# EAGLE board CharacterRom (EAGLE 7.3.0), part 1 of 2
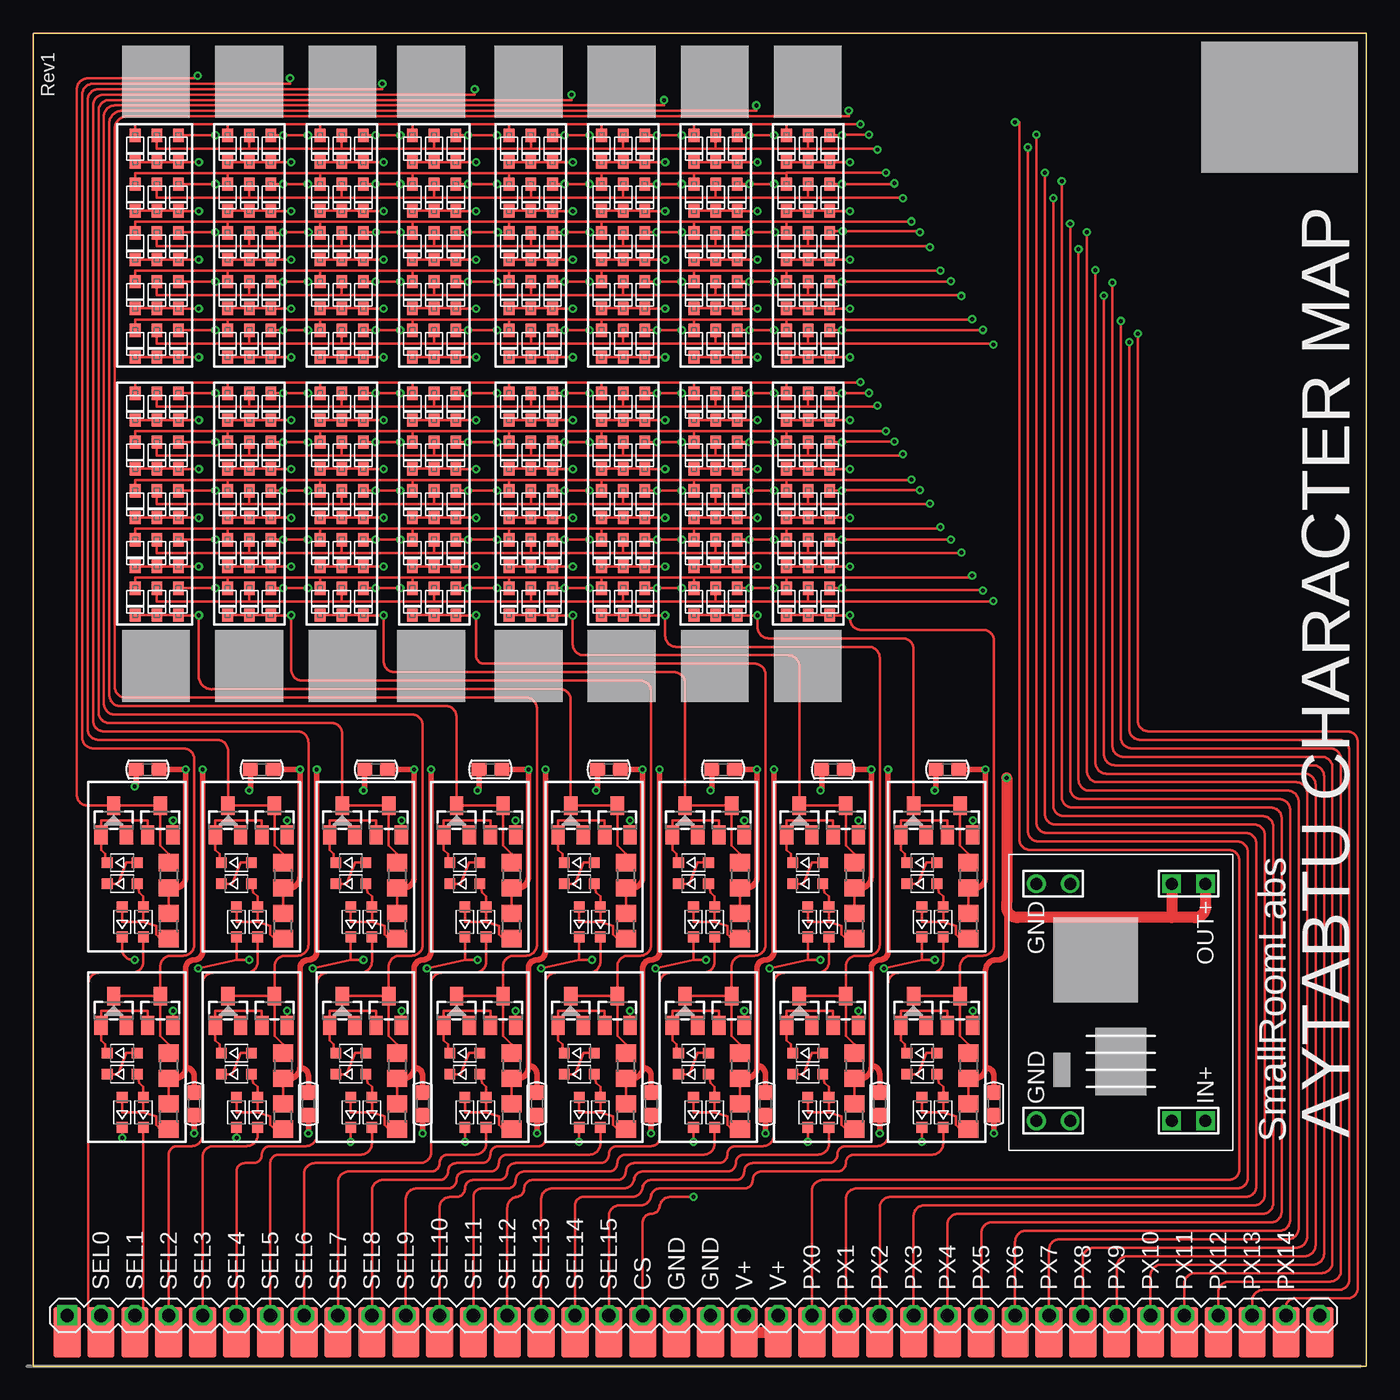
[diagram p3: board, top side]
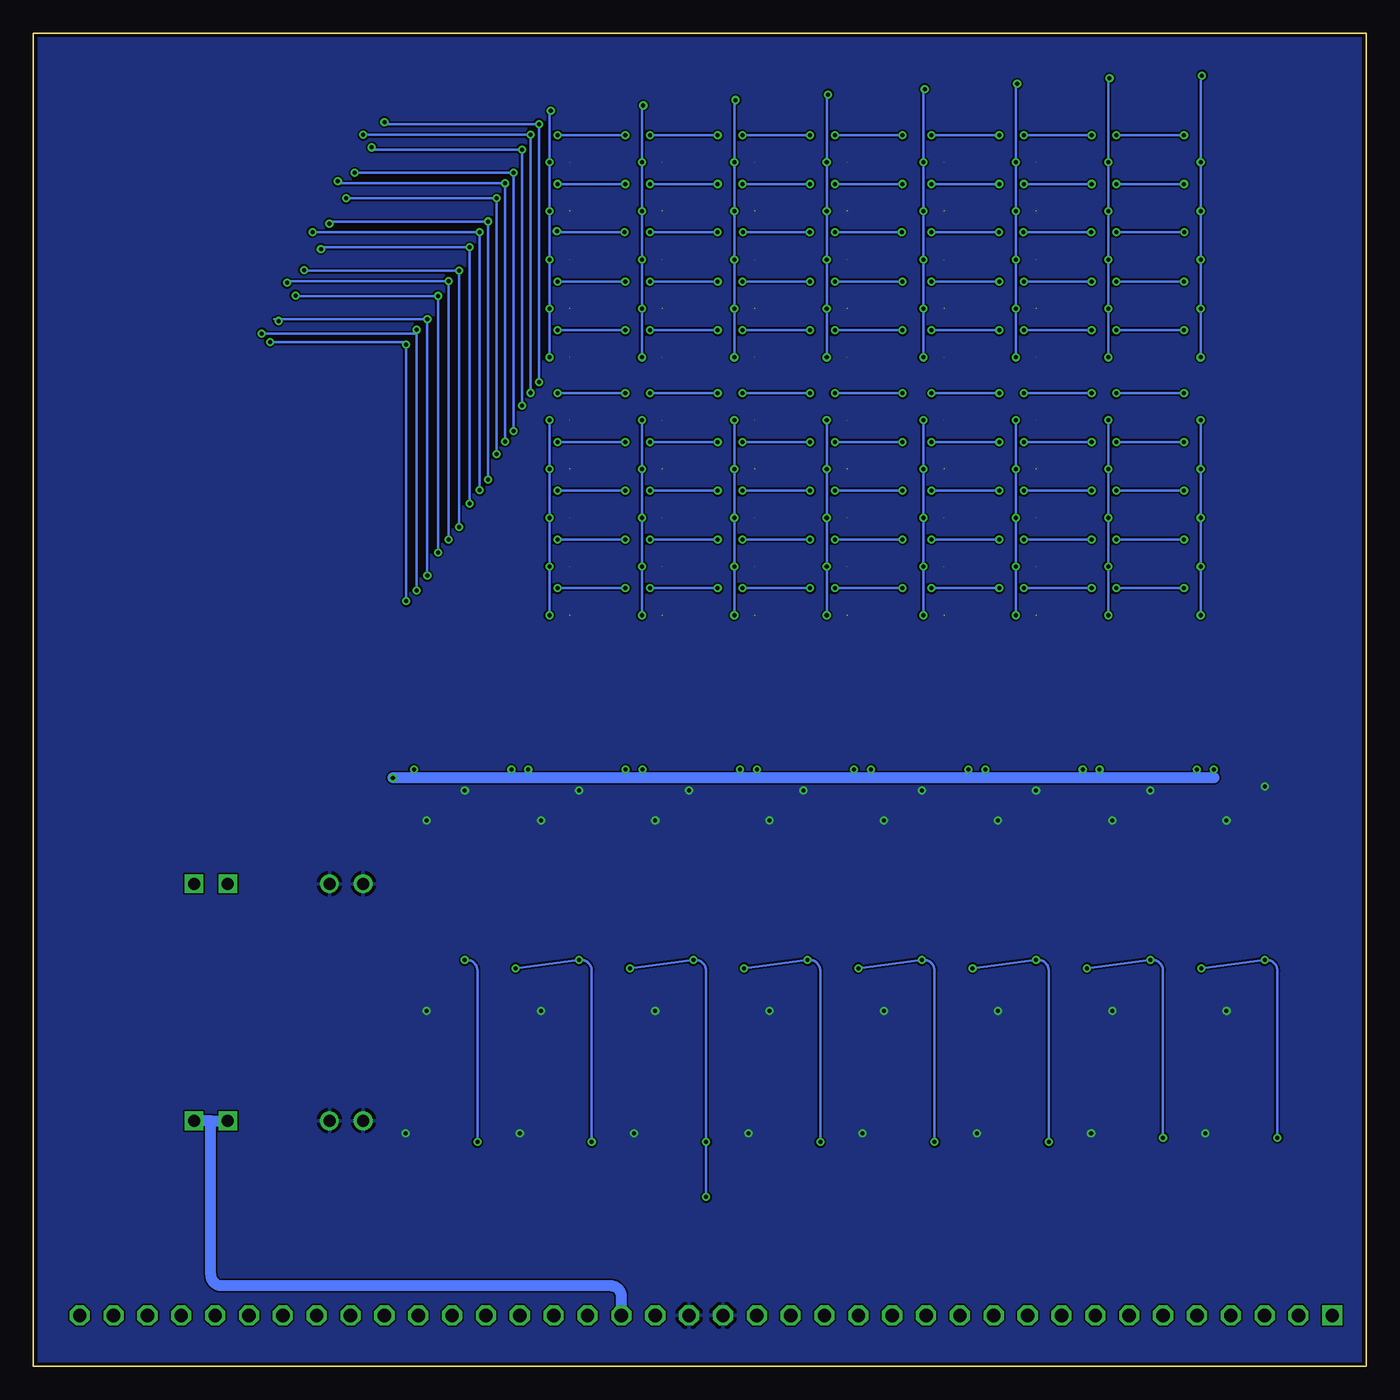
[diagram p4: board, bottom side, seen from below]

Size 100 x 100 mm. Coordinates in mm from the lower left corner, seen from the top.
Outline: 0,0 0,100 100,100 100,0 0,0
Copper layers (1*16): Top 0.035mm / dielectric 1.5mm / Bottom 0.035mm
Design rules "dirt_cheap_dirty_boards.v1": minimum track width 5mil, minimum drill 12mil, track to track 5mil, track to pad 5mil, pad to pad 5mil, via to via 5mil, smd to smd 0mil, copper to edge 10mil, drill to drill 10mil, minimum pad ring 10mil, minimum via ring 6mil, stop-mask expansion 2mil, vias tented up to drill 25mil, thermal gap 10mil

## Footprints (pad centres in the part's own frame; a part is rotated, then mirrored left to right if it is on the bottom)
C0603 = smd 1.1 x 1: 1 -0.85,0; 2 0.85,0
HD38-HOLEPAD = drill 1 square: P1@1 -46.99,0 | smd 2.032 x 3.81: P1@2 -46.99,-1.27; P2@2 -44.45,-1.27; P3@2 -41.91,-1.27; P4@2 -39.37,-1.27; P5@2 -36.83,-1.27; P6@2 -34.29,-1.27; P7@2 -31.75,-1.27; P8@2 -29.21,-1.27; P9@2 -26.67,-1.27; P10@2 -24.13,-1.27; P11@2 -21.59,-1.27; P12@2 -19.05,-1.27; P13@2 -16.51,-1.27; P14@2 -13.97,-1.27; P15@2 -11.43,-1.27; P16@2 -8.89,-1.27; P17@2 -6.35,-1.27; P18@2 -3.81,-1.27; P19@2 -1.27,-1.27; P20@2 1.27,-1.27; P21@2 3.81,-1.27; P22@2 6.35,-1.27; P23@2 8.89,-1.27; P24@2 11.43,-1.27; P25@2 13.97,-1.27; P26@2 16.51,-1.27; P27@2 19.05,-1.27; P28@2 21.59,-1.27; P29@2 24.13,-1.27; P30@2 26.67,-1.27; P31@2 29.21,-1.27; P32@2 31.75,-1.27; P33@2 34.29,-1.27; P34@2 36.83,-1.27; P35@2 39.37,-1.27; P36@2 41.91,-1.27; P37@2 44.45,-1.27; P38@2 46.99,-1.27 | drill 1 octagon: P2@1 -44.45,0; P3@1 -41.91,0; P4@1 -39.37,0; P5@1 -36.83,0; P6@1 -34.29,0; P7@1 -31.75,0; P8@1 -29.21,0; P9@1 -26.67,0; P10@1 -24.13,0; P11@1 -21.59,0; P12@1 -19.05,0; P13@1 -16.51,0; P14@1 -13.97,0; P15@1 -11.43,0; P16@1 -8.89,0; P17@1 -6.35,0; P18@1 -3.81,0; P19@1 -1.27,0; P20@1 1.27,0; P21@1 3.81,0; P22@1 6.35,0; P23@1 8.89,0; P24@1 11.43,0; P25@1 13.97,0; P26@1 16.51,0; P27@1 19.05,0; P28@1 21.59,0; P29@1 24.13,0; P30@1 26.67,0; P31@1 29.21,0; P32@1 31.75,0; P33@1 34.29,0; P34@1 36.83,0; P35@1 39.37,0; P36@1 41.91,0; P37@1 44.45,0; P38@1 46.99,0
SOD-323F = smd 1 x 0.8: A -1,0; C 1,0
SOD323F = smd 0.8 x 0.8: A 1.125,0; C -1.125,0
SOT23 = smd 1 x 1.4: 1 -0.95,-1.1; 2 0.95,-1.1; 3 0,1.1
R0805 = smd 1.3 x 1.5: 1 -0.95,0; 2 0.95,0
BUCK1722 = drill 0.9: GND@1 -8.89,6.35; GND@2 -8.89,3.81; GND@3 8.89,6.35; GND@4 8.89,3.81 | drill 0.9 square: IN@1 -8.89,-3.81; IN@2 -8.89,-6.35; OUT@1 8.89,-3.81; OUT@2 8.89,-6.35

## Placement (x,y rotation side)
C1  C0603-NPOL  [C0603]  8.57,44.77 180 top
C2  C0603-NPOL  [C0603]  17.14,44.77 180 top
C3  C0603-NPOL  [C0603]  25.72,44.77 180 top
C4  C0603-NPOL  [C0603]  34.29,44.77 180 top
C5  C0603-NPOL  [C0603]  43.18,44.77 180 top
C6  C0603-NPOL  [C0603]  51.75,44.77 180 top
C7  C0603-NPOL  [C0603]  60.01,44.77 180 top
C8  C0603-NPOL  [C0603]  68.58,44.77 180 top
C9  C0603-NPOL  [C0603]  12.06,19.68 270 top
C10  C0603-NPOL  [C0603]  20.64,19.68 270 top
C11  C0603-NPOL  [C0603]  29.21,19.68 270 top
C12  C0603-NPOL  [C0603]  37.78,19.68 270 top
C13  C0603-NPOL  [C0603]  46.35,19.68 270 top
C14  C0603-NPOL  [C0603]  54.93,19.68 270 top
C15  C0603-NPOL  [C0603]  63.5,19.68 270 top
C16  C0603-NPOL  [C0603]  72.07,19.68 270 top
CN3  HD38-HP  [HD38-HOLEPAD]  49.53,3.81 0 top
D1  [SOD-323F]  7.65,91.34 270 top
D2  [SOD-323F]  9.27,91.34 270 top
D3  [SOD-323F]  10.9,91.34 270 top
D4  [SOD-323F]  7.65,87.68 270 top
D5  [SOD-323F]  9.27,87.68 270 top
D6  [SOD-323F]  10.9,87.68 270 top
D7  [SOD-323F]  7.65,84.02 270 top
D8  [SOD-323F]  9.27,84.02 270 top
D9  [SOD-323F]  10.9,84.02 270 top
D10  [SOD-323F]  7.65,80.37 270 top
D11  [SOD-323F]  9.27,80.37 270 top
D12  [SOD-323F]  10.9,80.37 270 top
D13  [SOD-323F]  7.65,76.71 270 top
D14  [SOD-323F]  9.27,76.71 270 top
D15  [SOD-323F]  10.9,76.71 270 top
D16  [SOD-323F]  17.83,91.34 270 top
D17  [SOD-323F]  14.58,91.34 270 top
D18  [SOD-323F]  16.21,91.34 270 top
D19  [SOD-323F]  14.58,87.68 270 top
D20  [SOD-323F]  16.21,87.68 270 top
D21  [SOD-323F]  17.83,87.68 270 top
D22  [SOD-323F]  14.58,84.02 270 top
D23  [SOD-323F]  16.21,84.02 270 top
D24  [SOD-323F]  17.83,84.02 270 top
D25  [SOD-323F]  14.58,80.37 270 top
D26  [SOD-323F]  16.21,80.37 270 top
D27  [SOD-323F]  17.83,80.37 270 top
D28  [SOD-323F]  14.58,76.71 270 top
D29  [SOD-323F]  16.21,76.71 270 top
D30  [SOD-323F]  17.83,76.71 270 top
D31  [SOD-323F]  24.77,91.34 270 top
D32  [SOD-323F]  21.51,91.34 270 top
D33  [SOD-323F]  23.14,91.34 270 top
D34  [SOD-323F]  21.51,87.68 270 top
D35  [SOD-323F]  23.14,87.68 270 top
D36  [SOD-323F]  24.77,87.68 270 top
D37  [SOD-323F]  21.51,84.02 270 top
D38  [SOD-323F]  23.14,84.02 270 top
D39  [SOD-323F]  24.77,84.02 270 top
D40  [SOD-323F]  21.51,80.37 270 top
D41  [SOD-323F]  23.14,80.37 270 top
D42  [SOD-323F]  24.77,80.37 270 top
D43  [SOD-323F]  21.51,76.71 270 top
D44  [SOD-323F]  23.14,76.71 270 top
D45  [SOD-323F]  24.77,76.71 270 top
D46  [SOD-323F]  31.7,91.34 270 top
D47  [SOD-323F]  28.45,91.34 270 top
D48  [SOD-323F]  30.07,91.34 270 top
D49  [SOD-323F]  28.45,87.68 270 top
D50  [SOD-323F]  30.07,87.68 270 top
D51  [SOD-323F]  31.7,87.68 270 top
D52  [SOD-323F]  28.45,84.02 270 top
D53  [SOD-323F]  30.07,84.02 270 top
D54  [SOD-323F]  31.7,84.02 270 top
D55  [SOD-323F]  28.45,80.37 270 top
D56  [SOD-323F]  30.07,80.37 270 top
D57  [SOD-323F]  31.7,80.37 270 top
D58  [SOD-323F]  28.45,76.71 270 top
D59  [SOD-323F]  30.07,76.71 270 top
D60  [SOD-323F]  31.7,76.71 270 top
D61  [SOD-323F]  38.95,91.34 270 top
D62  [SOD-323F]  35.7,91.34 270 top
D63  [SOD-323F]  37.33,91.34 270 top
D64  [SOD-323F]  35.7,87.68 270 top
D65  [SOD-323F]  37.33,87.68 270 top
D66  [SOD-323F]  38.95,87.68 270 top
D67  [SOD-323F]  35.7,84.02 270 top
D68  [SOD-323F]  37.33,84.02 270 top
D69  [SOD-323F]  38.95,84.02 270 top
D70  [SOD-323F]  35.7,80.37 270 top
D71  [SOD-323F]  37.33,80.37 270 top
D72  [SOD-323F]  38.95,80.37 270 top
D73  [SOD-323F]  35.7,76.71 270 top
D74  [SOD-323F]  37.33,76.71 270 top
D75  [SOD-323F]  38.95,76.71 270 top
D76  [SOD-323F]  45.89,91.34 270 top
D77  [SOD-323F]  42.63,91.34 270 top
D78  [SOD-323F]  44.26,91.34 270 top
D79  [SOD-323F]  42.63,87.68 270 top
D80  [SOD-323F]  44.26,87.68 270 top
D81  [SOD-323F]  45.89,87.68 270 top
D82  [SOD-323F]  42.63,84.02 270 top
D83  [SOD-323F]  44.26,84.02 270 top
D84  [SOD-323F]  45.89,84.02 270 top
D85  [SOD-323F]  42.63,80.37 270 top
D86  [SOD-323F]  44.26,80.37 270 top
D87  [SOD-323F]  45.89,80.37 270 top
D88  [SOD-323F]  42.63,76.71 270 top
D89  [SOD-323F]  44.26,76.71 270 top
D90  [SOD-323F]  45.89,76.71 270 top
D91  [SOD-323F]  52.82,91.34 270 top
D92  [SOD-323F]  49.57,91.34 270 top
D93  [SOD-323F]  51.19,91.34 270 top
D94  [SOD-323F]  49.57,87.68 270 top
D95  [SOD-323F]  51.19,87.68 270 top
D96  [SOD-323F]  52.82,87.68 270 top
D97  [SOD-323F]  49.57,84.02 270 top
D98  [SOD-323F]  51.19,84.02 270 top
D99  [SOD-323F]  52.82,84.02 270 top
D100  [SOD-323F]  49.57,80.37 270 top
D101  [SOD-323F]  51.19,80.37 270 top
D102  [SOD-323F]  52.82,80.37 270 top
D103  [SOD-323F]  49.57,76.71 270 top
D104  [SOD-323F]  51.19,76.71 270 top
D105  [SOD-323F]  52.82,76.71 270 top
D106  [SOD-323F]  59.75,91.34 270 top
D107  [SOD-323F]  56.5,91.34 270 top
D108  [SOD-323F]  58.13,91.34 270 top
D109  [SOD-323F]  56.5,87.68 270 top
D110  [SOD-323F]  58.13,87.68 270 top
D111  [SOD-323F]  59.75,87.68 270 top
D112  [SOD-323F]  56.5,84.02 270 top
D113  [SOD-323F]  58.13,84.02 270 top
D114  [SOD-323F]  59.75,84.02 270 top
D115  [SOD-323F]  56.5,80.37 270 top
D116  [SOD-323F]  58.13,80.37 270 top
D117  [SOD-323F]  59.75,80.37 270 top
D118  [SOD-323F]  56.5,76.71 270 top
D119  [SOD-323F]  58.13,76.71 270 top
D120  [SOD-323F]  59.75,76.71 270 top
D121  [SOD-323F]  10.9,71.98 270 top
D122  [SOD-323F]  7.65,71.98 270 top
D123  [SOD-323F]  9.27,71.98 270 top
D124  [SOD-323F]  7.65,68.33 270 top
D125  [SOD-323F]  9.27,68.33 270 top
D126  [SOD-323F]  10.9,68.33 270 top
D127  [SOD-323F]  7.65,64.67 270 top
D128  [SOD-323F]  9.27,64.67 270 top
D129  [SOD-323F]  10.9,64.67 270 top
D130  [SOD-323F]  7.65,61.01 270 top
D131  [SOD-323F]  9.27,61.01 270 top
D132  [SOD-323F]  10.9,61.01 270 top
D133  [SOD-323F]  7.65,57.35 270 top
D134  [SOD-323F]  9.27,57.35 270 top
D135  [SOD-323F]  10.9,57.35 270 top
D136  [SOD-323F]  17.83,71.98 270 top
D137  [SOD-323F]  14.58,71.98 270 top
D138  [SOD-323F]  16.21,71.98 270 top
D139  [SOD-323F]  14.58,68.33 270 top
D140  [SOD-323F]  16.21,68.33 270 top
D141  [SOD-323F]  17.83,68.33 270 top
D142  [SOD-323F]  14.58,64.67 270 top
D143  [SOD-323F]  16.21,64.67 270 top
D144  [SOD-323F]  17.83,64.67 270 top
D145  [SOD-323F]  14.58,61.01 270 top
D146  [SOD-323F]  16.21,61.01 270 top
D147  [SOD-323F]  17.83,61.01 270 top
D148  [SOD-323F]  14.58,57.35 270 top
D149  [SOD-323F]  16.21,57.35 270 top
D150  [SOD-323F]  17.83,57.35 270 top
D151  [SOD-323F]  24.77,71.98 270 top
D152  [SOD-323F]  21.51,71.98 270 top
D153  [SOD-323F]  23.14,71.98 270 top
D154  [SOD-323F]  21.51,68.33 270 top
D155  [SOD-323F]  23.14,68.33 270 top
D156  [SOD-323F]  24.77,68.33 270 top
D157  [SOD-323F]  21.51,64.67 270 top
D158  [SOD-323F]  23.14,64.67 270 top
D159  [SOD-323F]  24.77,64.67 270 top
D160  [SOD-323F]  21.51,61.01 270 top
D161  [SOD-323F]  23.14,61.01 270 top
D162  [SOD-323F]  24.77,61.01 270 top
D163  [SOD-323F]  21.51,57.35 270 top
D164  [SOD-323F]  23.14,57.35 270 top
D165  [SOD-323F]  24.77,57.35 270 top
D166  [SOD-323F]  31.7,71.98 270 top
D167  [SOD-323F]  28.45,71.98 270 top
D168  [SOD-323F]  30.07,71.98 270 top
D169  [SOD-323F]  28.45,68.33 270 top
D170  [SOD-323F]  30.07,68.33 270 top
D171  [SOD-323F]  31.7,68.33 270 top
D172  [SOD-323F]  28.45,64.67 270 top
D173  [SOD-323F]  30.07,64.67 270 top
D174  [SOD-323F]  31.7,64.67 270 top
D175  [SOD-323F]  28.45,61.01 270 top
D176  [SOD-323F]  30.07,61.01 270 top
D177  [SOD-323F]  31.7,61.01 270 top
D178  [SOD-323F]  28.45,57.35 270 top
D179  [SOD-323F]  30.07,57.35 270 top
D180  [SOD-323F]  31.7,57.35 270 top
D181  [SOD-323F]  38.95,71.98 270 top
D182  [SOD-323F]  35.7,71.98 270 top
D183  [SOD-323F]  37.33,71.98 270 top
D184  [SOD-323F]  35.7,68.33 270 top
D185  [SOD-323F]  37.33,68.33 270 top
D186  [SOD-323F]  38.95,68.33 270 top
D187  [SOD-323F]  35.7,64.67 270 top
D188  [SOD-323F]  37.33,64.67 270 top
D189  [SOD-323F]  38.95,64.67 270 top
D190  [SOD-323F]  35.7,61.01 270 top
D191  [SOD-323F]  37.33,61.01 270 top
D192  [SOD-323F]  38.95,61.01 270 top
D193  [SOD-323F]  35.7,57.35 270 top
D194  [SOD-323F]  37.33,57.35 270 top
D195  [SOD-323F]  38.95,57.35 270 top
D196  [SOD-323F]  45.89,71.98 270 top
D197  [SOD-323F]  42.63,71.98 270 top
D198  [SOD-323F]  44.26,71.98 270 top
D199  [SOD-323F]  42.63,68.33 270 top
D200  [SOD-323F]  44.26,68.33 270 top
D201  [SOD-323F]  45.89,68.33 270 top
D202  [SOD-323F]  42.63,64.67 270 top
D203  [SOD-323F]  44.26,64.67 270 top
D204  [SOD-323F]  45.89,64.67 270 top
D205  [SOD-323F]  42.63,61.01 270 top
D206  [SOD-323F]  44.26,61.01 270 top
D207  [SOD-323F]  45.89,61.01 270 top
D208  [SOD-323F]  42.63,57.35 270 top
D209  [SOD-323F]  44.26,57.35 270 top
D210  [SOD-323F]  45.89,57.35 270 top
D211  [SOD-323F]  52.82,71.98 270 top
D212  [SOD-323F]  49.57,71.98 270 top
D213  [SOD-323F]  51.19,71.98 270 top
D214  [SOD-323F]  49.57,68.33 270 top
D215  [SOD-323F]  51.19,68.33 270 top
D216  [SOD-323F]  52.82,68.33 270 top
D217  [SOD-323F]  49.57,64.67 270 top
D218  [SOD-323F]  51.19,64.67 270 top
D219  [SOD-323F]  52.82,64.67 270 top
D220  [SOD-323F]  49.57,61.01 270 top
D221  [SOD-323F]  51.19,61.01 270 top
D222  [SOD-323F]  52.82,61.01 270 top
D223  [SOD-323F]  49.57,57.35 270 top
D224  [SOD-323F]  51.19,57.35 270 top
D225  [SOD-323F]  52.82,57.35 270 top
D226  [SOD-323F]  59.75,71.98 270 top
D227  [SOD-323F]  56.5,71.98 270 top
D228  [SOD-323F]  58.13,71.98 270 top
D229  [SOD-323F]  56.5,68.33 270 top
D230  [SOD-323F]  58.13,68.33 270 top
D231  [SOD-323F]  59.75,68.33 270 top
D232  [SOD-323F]  56.5,64.67 270 top
D233  [SOD-323F]  58.13,64.67 270 top
D234  [SOD-323F]  59.75,64.67 270 top
D235  [SOD-323F]  56.5,61.01 270 top
D236  [SOD-323F]  58.13,61.01 270 top
D237  [SOD-323F]  59.75,61.01 270 top
D238  [SOD-323F]  56.5,57.35 270 top
D239  [SOD-323F]  58.13,57.35 270 top
D240  [SOD-323F]  59.75,57.35 270 top
D256  DIODE-SOD323  [SOD323F]  6.67,23.5 0 top
D257  DIODE-SOD323  [SOD323F]  6.67,21.91 0 top
D258  DIODE-SOD323  [SOD323F]  8.26,19.05 90 top
D304  SCHOTTKYSOT323  [SOT23]  6.03,26.67 0 top
D305  DIODE-SOD323  [SOD323F]  6.67,19.05 90 top
D307  DIODE-SOD323  [SOD323F]  6.67,37.78 0 top
D308  DIODE-SOD323  [SOD323F]  6.67,36.2 0 top
D309  DIODE-SOD323  [SOD323F]  8.26,33.34 90 top
D310  SCHOTTKYSOT323  [SOT23]  6.03,40.96 0 top
D311  DIODE-SOD323  [SOD323F]  6.67,33.34 90 top
D611  DIODE-SOD323  [SOD323F]  15.24,23.5 0 top
D612  DIODE-SOD323  [SOD323F]  15.24,21.91 0 top
D613  DIODE-SOD323  [SOD323F]  16.83,19.05 90 top
D614  SCHOTTKYSOT323  [SOT23]  14.61,26.67 0 top
D615  DIODE-SOD323  [SOD323F]  15.24,19.05 90 top
D616  DIODE-SOD323  [SOD323F]  15.24,37.78 0 top
D617  DIODE-SOD323  [SOD323F]  15.24,36.2 0 top
D618  DIODE-SOD323  [SOD323F]  16.83,33.34 90 top
D619  SCHOTTKYSOT323  [SOT23]  14.61,40.96 0 top
D620  DIODE-SOD323  [SOD323F]  15.24,33.34 90 top
D621  DIODE-SOD323  [SOD323F]  23.81,23.5 0 top
D622  DIODE-SOD323  [SOD323F]  23.81,21.91 0 top
D623  DIODE-SOD323  [SOD323F]  25.4,19.05 90 top
D624  SCHOTTKYSOT323  [SOT23]  23.18,26.67 0 top
D625  DIODE-SOD323  [SOD323F]  23.81,19.05 90 top
D626  DIODE-SOD323  [SOD323F]  23.81,37.78 0 top
D627  DIODE-SOD323  [SOD323F]  23.81,36.2 0 top
D628  DIODE-SOD323  [SOD323F]  25.4,33.34 90 top
D629  SCHOTTKYSOT323  [SOT23]  23.18,40.96 0 top
D630  DIODE-SOD323  [SOD323F]  23.81,33.34 90 top
D631  DIODE-SOD323  [SOD323F]  32.38,23.5 0 top
D632  DIODE-SOD323  [SOD323F]  32.38,21.91 0 top
D633  DIODE-SOD323  [SOD323F]  33.97,19.05 90 top
D634  SCHOTTKYSOT323  [SOT23]  31.75,26.67 0 top
D635  DIODE-SOD323  [SOD323F]  32.38,19.05 90 top
D636  DIODE-SOD323  [SOD323F]  32.38,37.78 0 top
D637  DIODE-SOD323  [SOD323F]  32.38,36.2 0 top
D638  DIODE-SOD323  [SOD323F]  33.97,33.34 90 top
D639  SCHOTTKYSOT323  [SOT23]  31.75,40.96 0 top
D640  DIODE-SOD323  [SOD323F]  32.38,33.34 90 top
D641  DIODE-SOD323  [SOD323F]  40.96,23.5 0 top
D642  DIODE-SOD323  [SOD323F]  40.96,21.91 0 top
D643  DIODE-SOD323  [SOD323F]  42.55,19.05 90 top
D644  SCHOTTKYSOT323  [SOT23]  40.32,26.67 0 top
D645  DIODE-SOD323  [SOD323F]  40.96,19.05 90 top
D646  DIODE-SOD323  [SOD323F]  40.96,37.78 0 top
D647  DIODE-SOD323  [SOD323F]  40.96,36.2 0 top
D648  DIODE-SOD323  [SOD323F]  42.55,33.34 90 top
D649  SCHOTTKYSOT323  [SOT23]  40.32,40.96 0 top
D650  DIODE-SOD323  [SOD323F]  40.96,33.34 90 top
D651  DIODE-SOD323  [SOD323F]  49.53,23.5 0 top
D652  DIODE-SOD323  [SOD323F]  49.53,21.91 0 top
D653  DIODE-SOD323  [SOD323F]  51.12,19.05 90 top
D654  SCHOTTKYSOT323  [SOT23]  48.9,26.67 0 top
D655  DIODE-SOD323  [SOD323F]  49.53,19.05 90 top
D656  DIODE-SOD323  [SOD323F]  49.53,37.78 0 top
D657  DIODE-SOD323  [SOD323F]  49.53,36.2 0 top
D658  DIODE-SOD323  [SOD323F]  51.12,33.34 90 top
D659  SCHOTTKYSOT323  [SOT23]  48.9,40.96 0 top
D660  DIODE-SOD323  [SOD323F]  49.53,33.34 90 top
D661  DIODE-SOD323  [SOD323F]  58.1,23.5 0 top
D662  DIODE-SOD323  [SOD323F]  58.1,21.91 0 top
D663  DIODE-SOD323  [SOD323F]  59.69,19.05 90 top
D664  SCHOTTKYSOT323  [SOT23]  57.47,26.67 0 top
D665  DIODE-SOD323  [SOD323F]  58.1,19.05 90 top
D666  DIODE-SOD323  [SOD323F]  58.1,37.78 0 top
D667  DIODE-SOD323  [SOD323F]  58.1,36.2 0 top
D668  DIODE-SOD323  [SOD323F]  59.69,33.34 90 top
D669  SCHOTTKYSOT323  [SOT23]  57.47,40.96 0 top
D670  DIODE-SOD323  [SOD323F]  58.1,33.34 90 top
D671  DIODE-SOD323  [SOD323F]  66.67,23.5 0 top
D672  DIODE-SOD323  [SOD323F]  66.67,21.91 0 top
D673  DIODE-SOD323  [SOD323F]  68.26,19.05 90 top
D674  SCHOTTKYSOT323  [SOT23]  66.04,26.67 0 top
D675  DIODE-SOD323  [SOD323F]  66.67,19.05 90 top
D676  DIODE-SOD323  [SOD323F]  66.67,37.78 0 top
D677  DIODE-SOD323  [SOD323F]  66.67,36.2 0 top
D678  DIODE-SOD323  [SOD323F]  68.26,33.34 90 top
D679  SCHOTTKYSOT323  [SOT23]  66.04,40.96 0 top
D680  DIODE-SOD323  [SOD323F]  66.67,33.34 90 top
Q1  BC547-SOT23  [SOT23]  9.53,26.67 0 top
Q2  BC547-SOT23  [SOT23]  9.53,40.96 0 top
Q33  BC547-SOT23  [SOT23]  18.1,26.67 0 top
Q34  BC547-SOT23  [SOT23]  18.1,40.96 0 top
Q35  BC547-SOT23  [SOT23]  26.67,26.67 0 top
Q36  BC547-SOT23  [SOT23]  26.67,40.96 0 top
Q37  BC547-SOT23  [SOT23]  35.24,26.67 0 top
Q38  BC547-SOT23  [SOT23]  35.24,40.96 0 top
Q39  BC547-SOT23  [SOT23]  43.81,26.67 0 top
Q40  BC547-SOT23  [SOT23]  43.81,40.96 0 top
Q41  BC547-SOT23  [SOT23]  52.39,26.67 0 top
Q42  BC547-SOT23  [SOT23]  52.39,40.96 0 top
Q43  BC547-SOT23  [SOT23]  60.96,26.67 0 top
Q44  BC547-SOT23  [SOT23]  60.96,40.96 0 top
Q45  BC547-SOT23  [SOT23]  69.53,26.67 0 top
Q46  BC547-SOT23  [SOT23]  69.53,40.96 0 top
R1  470  [R0805]  10.16,18.73 90 top
R2  150  [R0805]  10.16,22.54 270 top
R3  150  [R0805]  10.16,36.83 270 top
R4  470  [R0805]  10.16,33.02 90 top
R36  150  [R0805]  18.73,22.54 270 top
R37  470  [R0805]  18.73,18.73 90 top
R45  150  [R0805]  18.73,36.83 270 top
R68  470  [R0805]  18.73,33.02 90 top
R69  150  [R0805]  27.3,22.54 270 top
R70  470  [R0805]  27.3,18.73 90 top
R71  150  [R0805]  27.3,36.83 270 top
R72  470  [R0805]  27.3,33.02 90 top
R73  150  [R0805]  35.88,22.54 270 top
R74  470  [R0805]  35.88,18.73 90 top
R75  150  [R0805]  35.88,36.83 270 top
R76  470  [R0805]  35.88,33.02 90 top
R77  150  [R0805]  44.45,22.54 270 top
R78  470  [R0805]  44.45,18.73 90 top
R79  150  [R0805]  44.45,36.83 270 top
R80  470  [R0805]  44.45,33.02 90 top
R81  150  [R0805]  53.02,22.54 270 top
R82  470  [R0805]  53.02,18.73 90 top
R83  150  [R0805]  53.02,36.83 270 top
R84  470  [R0805]  53.02,33.02 90 top
R85  150  [R0805]  61.59,22.54 270 top
R86  470  [R0805]  61.59,18.73 90 top
R87  150  [R0805]  61.59,36.83 270 top
R88  470  [R0805]  61.59,33.02 90 top
R89  150  [R0805]  70.17,22.54 270 top
R90  470  [R0805]  70.17,18.73 90 top
R91  150  [R0805]  70.17,36.83 270 top
R92  470  [R0805]  70.17,33.02 90 top
VR1  SMPS  [BUCK1722]  81.6,27.3 90 top